# EAGLE design frontpanel (EAGLE 9.5.2)
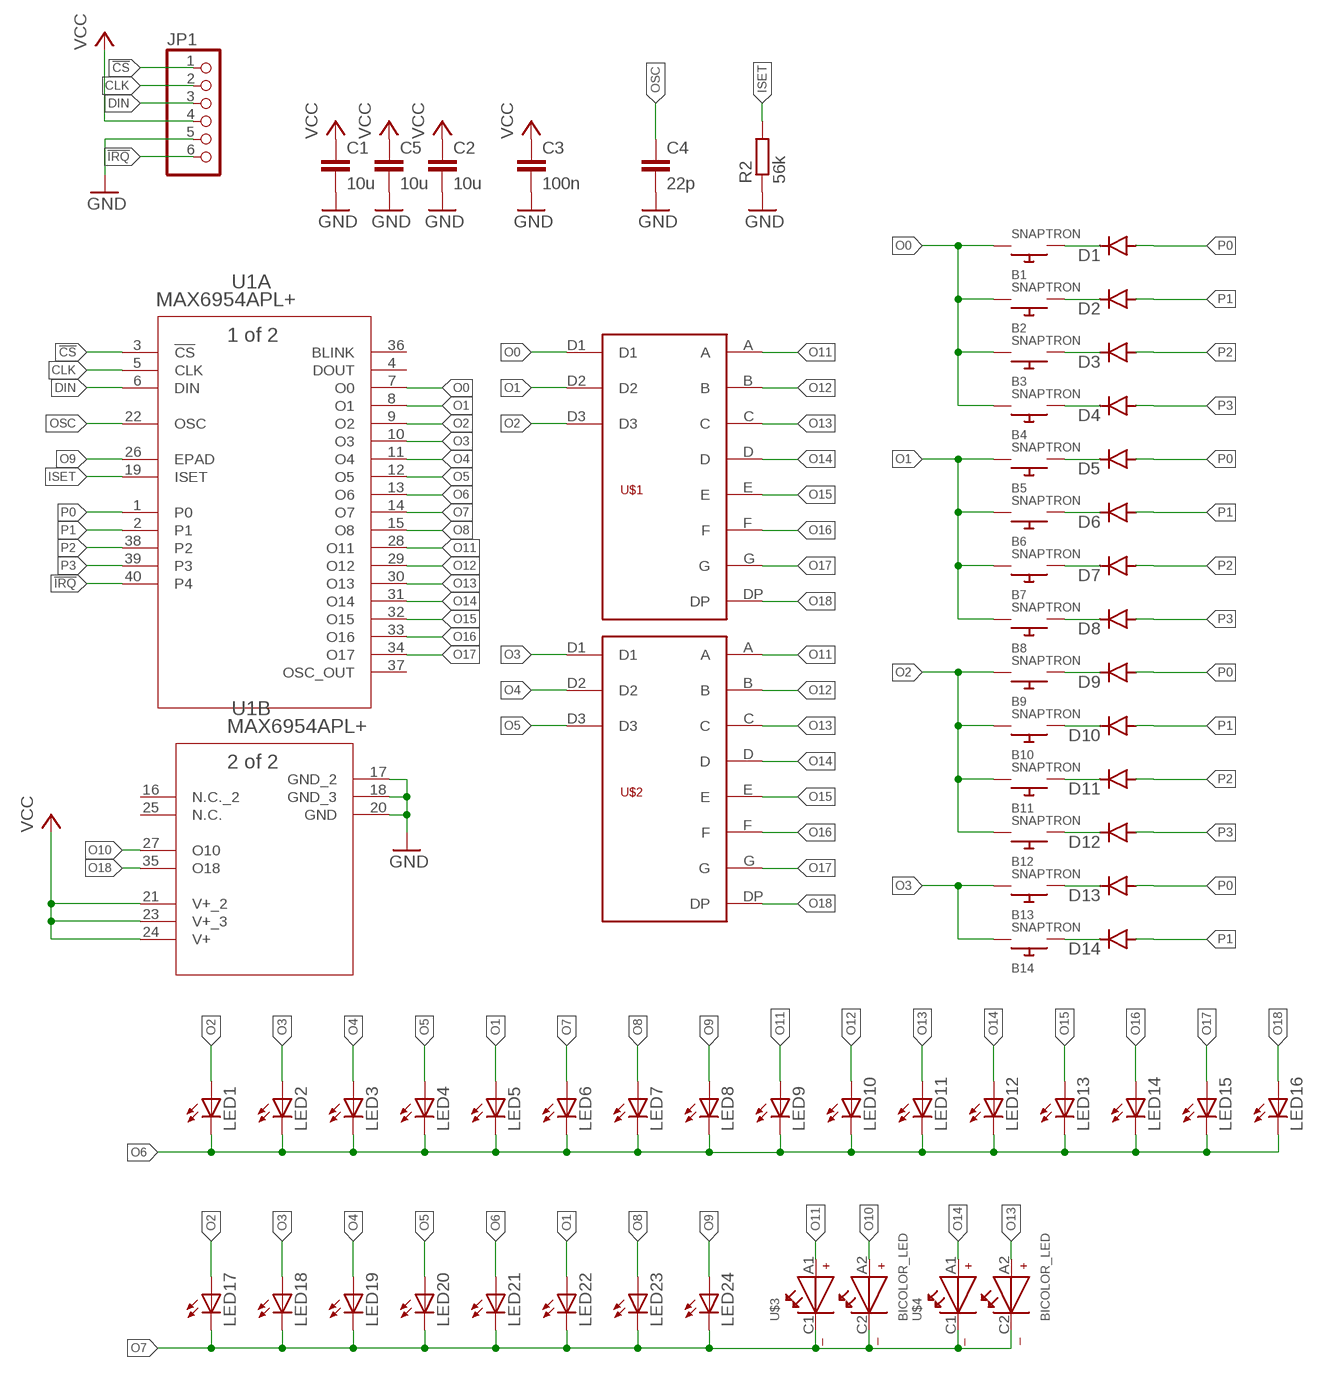
[diagram p0: schematic, sheet 1]

## Parts
B1  SNAPTRON  [SNAPTRON-8.5]
B2  SNAPTRON  [SNAPTRON-8.5]
B3  SNAPTRON  [SNAPTRON-8.5]
B4  SNAPTRON  [SNAPTRON-8.5]
B5  SNAPTRON  [SNAPTRON-8.5]
B6  SNAPTRON  [SNAPTRON-8.5]
B7  SNAPTRON  [SNAPTRON-8.5]
B8  SNAPTRON  [SNAPTRON-8.5]
B9  SNAPTRON  [SNAPTRON-8.5]
B10  SNAPTRON  [SNAPTRON-8.5]
B11  SNAPTRON  [SNAPTRON-8.5]
B12  SNAPTRON  [SNAPTRON-8.5]
B13  SNAPTRON  [SNAPTRON-8.5]
B14  SNAPTRON  [SNAPTRON-8.5]
C1  10u  C-EUC0805  [C0805]
C2  10u  C-EUC0805  [C0805]
C3  100n  C-EUC0805  [C0805]
C4  22p  C-EUC0805  [C0805]
C5  10u  C-EUC0805  [C0805]
D1  1N4148DO35-10  [DO35-10]
D2  1N4148DO35-10  [DO35-10]
D3  1N4148DO35-10  [DO35-10]
D4  1N4148DO35-10  [DO35-10]
D5  1N4148DO35-10  [DO35-10]
D6  1N4148DO35-10  [DO35-10]
D7  1N4148DO35-10  [DO35-10]
D8  1N4148DO35-10  [DO35-10]
D9  1N4148DO35-10  [DO35-10]
D10  1N4148DO35-10  [DO35-10]
D11  1N4148DO35-10  [DO35-10]
D12  1N4148DO35-10  [DO35-10]
D13  1N4148DO35-10  [DO35-10]
D14  1N4148DO35-10  [DO35-10]
JP1  PINHD-1X6  [1X06]
LED1  LEDCHIP-LED0805  [CHIP-LED0805]
LED2  LEDCHIP-LED0805  [CHIP-LED0805]
LED3  LEDCHIP-LED0805  [CHIP-LED0805]
LED4  LEDCHIP-LED0805  [CHIP-LED0805]
LED5  LEDCHIP-LED0805  [CHIP-LED0805]
LED6  LEDCHIP-LED0805  [CHIP-LED0805]
LED7  LEDCHIP-LED0805  [CHIP-LED0805]
LED8  LEDCHIP-LED0805  [CHIP-LED0805]
LED9  LEDCHIP-LED0805  [CHIP-LED0805]
LED10  LEDCHIP-LED0805  [CHIP-LED0805]
LED11  LEDCHIP-LED0805  [CHIP-LED0805]
LED12  LEDCHIP-LED0805  [CHIP-LED0805]
LED13  LEDCHIP-LED0805  [CHIP-LED0805]
LED14  LEDCHIP-LED0805  [CHIP-LED0805]
LED15  LEDCHIP-LED0805  [CHIP-LED0805]
LED16  LEDCHIP-LED0805  [CHIP-LED0805]
LED17  LEDCHIP-LED0805  [CHIP-LED0805]
LED18  LEDCHIP-LED0805  [CHIP-LED0805]
LED19  LEDCHIP-LED0805  [CHIP-LED0805]
LED20  LEDCHIP-LED0805  [CHIP-LED0805]
LED21  LEDCHIP-LED0805  [CHIP-LED0805]
LED22  LEDCHIP-LED0805  [CHIP-LED0805]
LED23  LEDCHIP-LED0805  [CHIP-LED0805]
LED24  LEDCHIP-LED0805  [CHIP-LED0805]
R2  56k  R-EU_R0805  [R0805]
U1  MAX6954APL+  [21-0044B_40_MXM]
U$1  3-DIGIT_7-SEGMENT-DISPLAY  [3-DIGIT_7-SEGMENT-DISPLAY]
U$2  3-DIGIT_7-SEGMENT-DISPLAY  [3-DIGIT_7-SEGMENT-DISPLAY]
U$3  BICOLOR_LED  [BICOLOR_LED]
U$4  BICOLOR_LED  [BICOLOR_LED]

## Nets
!CS: JP1.1 U1.3(A:!CS)
!IRQ: JP1.6 U1.40(A:P4)
CLK: JP1.2 U1.5(A:CLK)
DIN: JP1.3 U1.6(A:DIN)
GND: C1.2 C2.2 C3.2 C4.2 C5.2 JP1.5 R2.1 U1.17(B:GND_2) U1.18(B:GND_3) U1.20(B:GND)
ISET: R2.2 U1.19(A:ISET)
N$1: B1.P$2 D1.C
N$2: B2.P$2 D2.C
N$3: B5.P$2 D5.C
N$4: B3.P$2 D3.C
N$5: B4.P$2 D4.C
N$6: B6.P$2 D6.C
N$7: B7.P$2 D7.C
N$8: B8.P$2 D8.C
N$9: B9.P$2 D9.C
N$10: B10.P$2 D10.C
N$11: B11.P$2 D11.C
N$12: B12.P$2 D12.C
N$13: B13.P$2 D13.C
N$14: B14.P$2 D14.C
O0: B1.P$1 B2.P$1 B3.P$1 B4.P$1 U1.7(A:O0) U$1.D1
O1: B5.P$1 B6.P$1 B7.P$1 B8.P$1 LED5.A LED22.A U1.8(A:O1) U$1.D2
O2: B9.P$1 B10.P$1 B11.P$1 B12.P$1 LED1.A LED17.A U1.9(A:O2) U$1.D3
O3: B13.P$1 B14.P$1 LED2.A LED18.A U1.10(A:O3) U$2.D1
O4: LED3.A LED19.A U1.11(A:O4) U$2.D2
O5: LED4.A LED20.A U1.12(A:O5) U$2.D3
O6: LED1.C LED2.C LED3.C LED4.C LED5.C LED6.C LED7.C LED8.C LED9.C LED10.C LED11.C LED12.C LED13.C LED14.C LED15.C LED16.C LED21.A U1.13(A:O6)
O7: LED6.A LED17.C LED18.C LED19.C LED20.C LED21.C LED22.C LED23.C LED24.C U1.14(A:O7) U$3.C1 U$3.C2 U$4.C1 U$4.C2
O8: LED7.A LED23.A U1.15(A:O8)
O9: LED8.A LED24.A U1.26(A:EPAD)
O10: U1.27(B:O10) U$3.A2
O11: LED9.A U1.28(A:O11) U$1.A U$2.A U$3.A1
O12: LED10.A U1.29(A:O12) U$1.B U$2.B
O13: LED11.A U1.30(A:O13) U$1.C U$2.C U$4.A2
O14: LED12.A U1.31(A:O14) U$1.D U$2.D U$4.A1
O15: LED13.A U1.32(A:O15) U$1.E U$2.E
O16: LED14.A U1.33(A:O16) U$1.F U$2.F
O17: LED15.A U1.34(A:O17) U$1.G U$2.G
O18: LED16.A U1.35(B:O18) U$1.DP U$2.DP
OSC: C4.1 U1.22(A:OSC)
P0: D1.A D5.A D9.A D13.A U1.1(A:P0)
P1: D2.A D6.A D10.A D14.A U1.2(A:P1)
P2: D3.A D7.A D11.A U1.38(A:P2)
P3: D4.A D8.A D12.A U1.39(A:P3)
VCC: C1.1 C2.1 C3.1 C5.1 JP1.4 U1.21(B:V+_2) U1.23(B:V+_3) U1.24(B:V+)
Unconnected: U1.4(A:DOUT) U1.16(B:N.C._2) U1.25(B:N.C.) U1.36(A:BLINK) U1.37(A:OSC_OUT)

## Library data of the parts
B1-B14 = 7_segment_lib:SNAPTRON
C1-C5 = rcl:C-EU: CAPACITOR, European symbol; SPICEPREFIX: C
D1-D14 = diode:1N4148: DIODE high speed (Philips)
JP1 = pinhead:PINHD-1X6: PIN HEADER
LED1-LED24 = adafruit:LED: LED OSRAM: - CHIPLED LG R971, LG N971, LY N971, LG Q971, LY Q971, LO R971, LY R971 LH N974, LH R974 LS Q976, LO Q976, LY Q976 LO Q996 - Hyper CHIPLED LW Q18S LB Q993, LB Q99A, LB R99A - SideLED LS A670, LO A670, LY A670, LG A670, LP A670 LB A673, LV A673, LT A673, LW A673 LH A674 LY A675 LS A676, LA A676, LO A676, LY A676, LW A676 LS A679, LY A679, LG A679 - Hyper Micro SIDELED® LS Y876, LA Y876, LO Y876, LY Y876 LT Y87S - SmartLED LW L88C, LW L88S LB L89C, LB L89S, LG L890 LS L89K, LO L89K, LY L89K LS L896, LA L896, LO L896, LY L896 - TOPLED LS T670, LO T670, LY T670, LG T670, LP T670 LSG T670, LSP T670, LSY T670, LOP T670, LYG T670 LG T671, LOG T671, LSG T671 LB T673, LV T673, LT T673, LW T673 LH T674 LS T676, LA T676, LO T676, LY T676, LB T676, LH T676, LSB T676, LW T676 LB T67C, LV T67C, LT T67C, LS T67K, LO T67K, LY T67K, LW E67C LS E67B, LA E67B, LO E67B, LY E67B, LB E67C, LV E67C, LT E67C LW T67C LS T679, LY T679, LG T679 LS T770, LO T770, LY T770, LG T770, LP T770 LB T773, LV T773, LT T773, LW T773 LH T774 LS E675, LA E675, LY E675, LS T675 LS T776, LA T776, LO T776, LY T776, LB T776 LHGB T686 LT T68C, LB T68C - Hyper Mini TOPLED® LB M676 - Mini TOPLED Santana® LG M470 LS M47K, LO M47K, LY M47K Source: http://www.osram.convergy.de/
R2 = rcl:R-EU_: RESISTOR, European symbol; SPICEPREFIX: R
U1 = 7_segment_lib:MAX6954APL+; BUILT_BY: EMA_UL_Team; MANUFACTURER_PART_NUMBER: MAX6954APL+; SOURCELIBRARY: Maxim_2014-05-21; VENDOR: Maxim Integrated Products
U$1 U$2 = 7_segment_lib:3-DIGIT_7-SEGMENT-DISPLAY
U$3 U$4 = 7_segment_lib:BICOLOR_LED

## Board
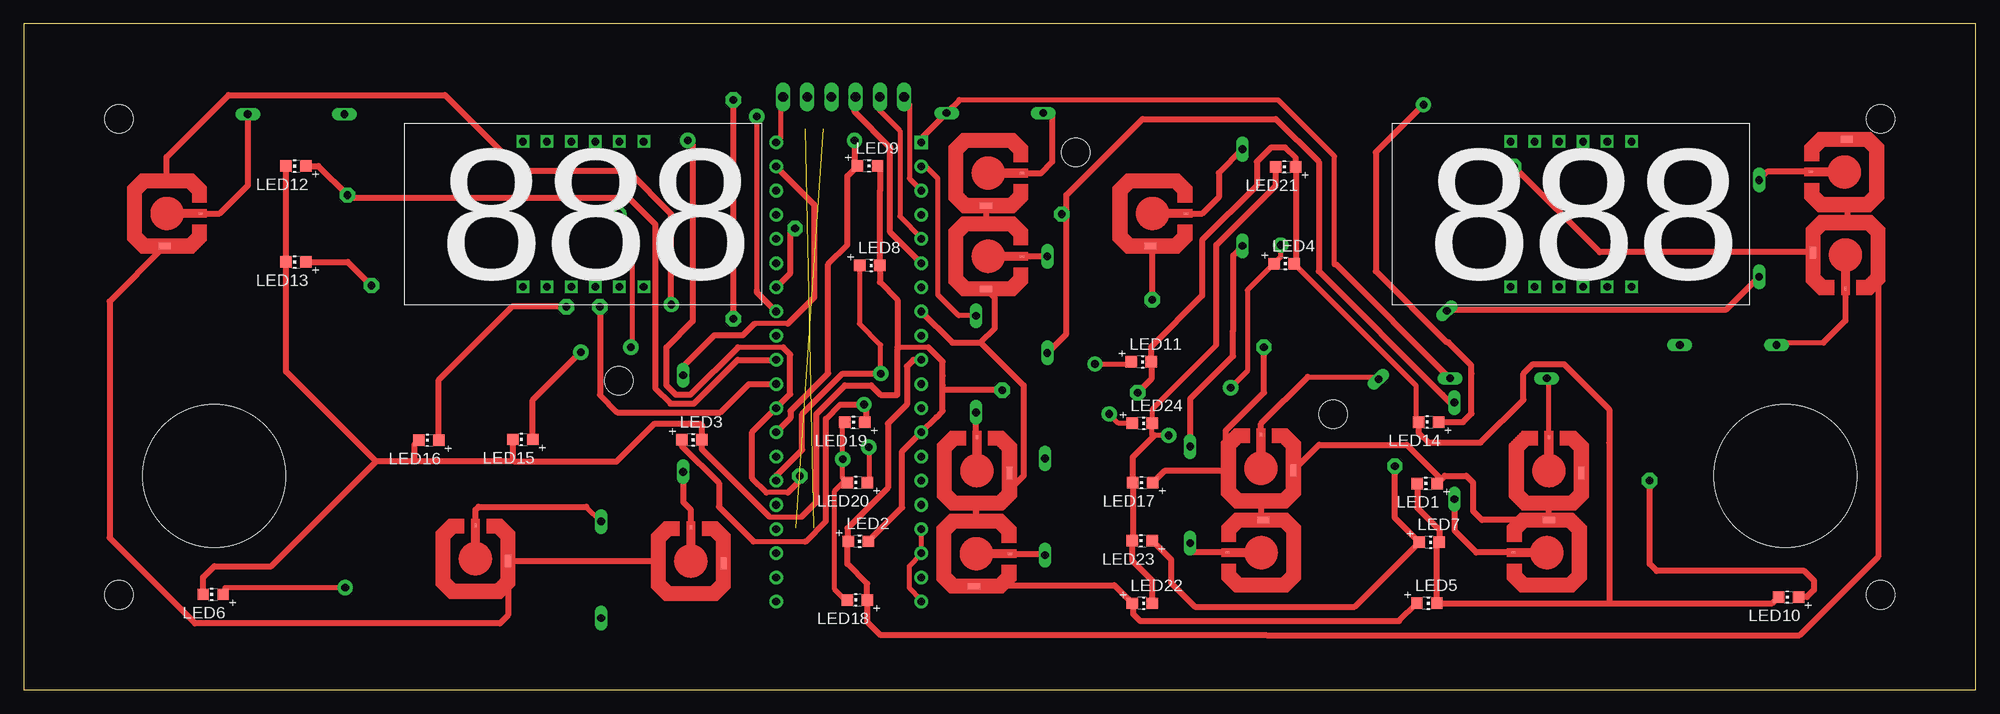
[diagram p1: board, top side]
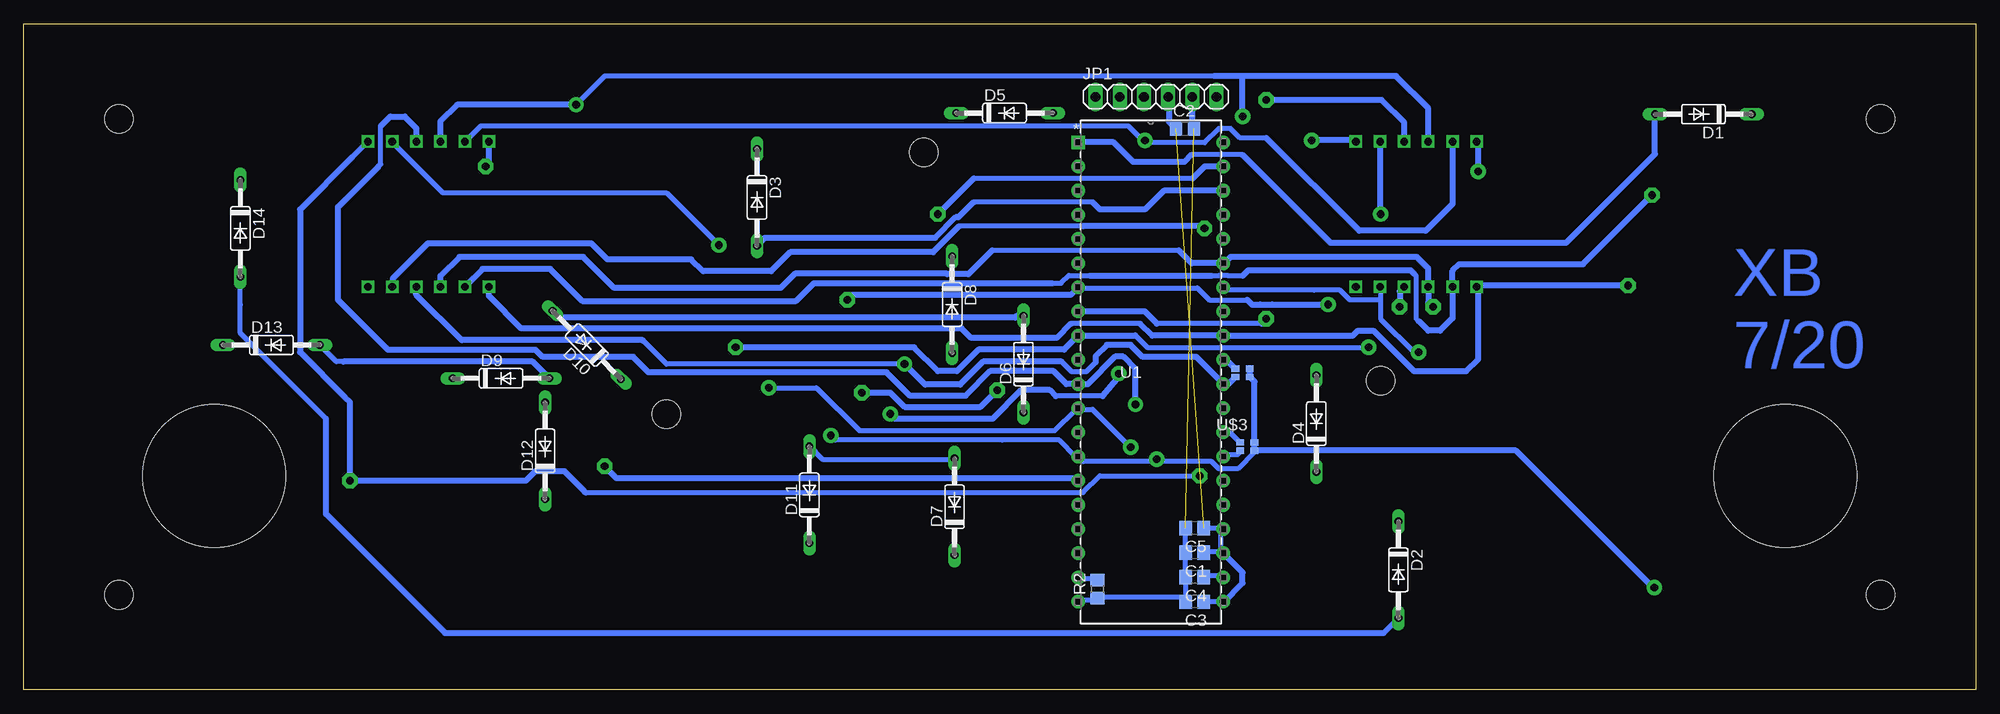
[diagram p2: board, bottom side, seen from below]

Size 205 x 70 mm. Coordinates in mm from the lower left corner, seen from the top.
Outline: 0,0 205,0 205,70 0,70 0,0
Copper layers (1*16): Top 0.035mm / dielectric 1.5mm / Bottom 0.035mm
Design rules "default *": minimum track width 20mil, minimum drill 0.8mm, track to track 12mil, track to pad 10mil, pad to pad 16mil, via to via 16mil, smd to smd 4mil, copper to edge 2mil, drill to drill 6mil, minimum pad ring 10mil, minimum via ring 16mil, stop-mask expansion 4mil, vias tented up to drill 0mil, thermal gap 10mil
Holes 15 mm at 20,22.5 185,22.5
Holes 3 mm at 10,10 10,60 195,10 195,60 62.5,32.5 137.5,29 110.5,56.5

### Footprints (pad centres in the part's own frame; a part is rotated, then mirrored left to right if it is on the bottom)
SNAPTRON-8.5 = smd 1.27 x 0.635: P$1 -0.191,-3.352 | smd 0.406 x 0.203: P$2 3.568,0.056
C0805 = smd 1.3 x 1.5: 1 -0.95,0; 2 0.95,0
DO35-10 = drill 0.813 long: A 5.08,0; C -5.08,0
1X06 = drill 1.016 long: 1 -6.35,0; 2 -3.81,0; 3 -1.27,0; 4 1.27,0; 5 3.81,0; 6 6.35,0
CHIP-LED0805 = smd 1.2 x 1.2: A 0,-1.05; C 0,1.05
R0805 = smd 1.3 x 1.5: 1 -0.95,0; 2 0.95,0
21-0044B_40_MXM = drill 0.8 pad 1.422 square: 1 0,0 | drill 0.8 pad 1.422: 2 0,-2.54; 3 0,-5.08; 4 0,-7.62; 5 0,-10.16; 6 0,-12.7; 7 0,-15.24; 8 0,-17.78; 9 0,-20.32; 10 0,-22.86; 11 0,-25.4; 12 0,-27.94; 13 0,-30.48; 14 0,-33.02; 15 0,-35.56; 16 0,-38.1; 17 0,-40.64; 18 0,-43.18; 19 0,-45.72; 20 0,-48.26; 21 15.24,-48.26; 22 15.24,-45.72; 23 15.24,-43.18; 24 15.24,-40.64; 25 15.24,-38.1; 26 15.24,-35.56; 27 15.24,-33.02; 28 15.24,-30.48; 29 15.24,-27.94; 30 15.24,-25.4; 31 15.24,-22.86; 32 15.24,-20.32; 33 15.24,-17.78; 34 15.24,-15.24; 35 15.24,-12.7; 36 15.24,-10.16; 37 15.24,-7.62; 38 15.24,-5.08; 39 15.24,-2.54; 40 15.24,0
3-DIGIT_7-SEGMENT-DISPLAY = drill 0.8 square: A -3.81,7.62; B 6.35,7.62; C 1.27,-7.62; D -3.81,-7.62; D1 -6.35,7.62; D2 1.27,7.62; D3 3.81,7.62; DP -1.25,-7.62; E -6.35,-7.62; F -1.25,7.62; G 3.81,-7.62; NC 6.35,-7.62
BICOLOR_LED = smd 0.8 x 0.65: A1 0,0; A2 0,-0.85; C1 1.5,0; C2 1.5,-0.85

### Placement (x,y rotation side)
B1  15,50 0 top
B2  47.5,13.75 90 top
B3  118.5,50 0 top
B4  70.12,13.5 90 top
B5  101.25,54.25 0 top
B6  100.17,23 90 top
B7  100,14.25 0 top
B8  101.25,45.5 0 top
B9  160.25,23 90 top
B10  130,23.25 90 top
B11  130,14.5 180 top
B12  160,14.5 180 top
B13  191.25,45.75 270 top
B14  191.25,54.5 180 top
C1  82.03,14.44 180 bottom
C2  83.05,58.98 0 bottom
C3  82.03,9.27 180 bottom
C4  82.03,11.85 180 bottom
C5  82.03,17.02 180 bottom
D1  28.6,60.5 180 bottom
D2  60.62,12.62 270 bottom
D3  128,51.75 270 bottom
D4  69.25,28 90 bottom
D5  102,60.62 0 bottom
D6  100,34.25 90 bottom
D7  107.25,19.25 90 bottom
D8  107.5,40.5 270 bottom
D9  154.88,32.75 0 bottom
D10  145.88,36.25 135 bottom
D11  122.5,20.5 90 bottom
D12  150.25,25.12 90 bottom
D13  179,36.25 0 bottom
D14  182.25,48.5 270 bottom
JP1  86.09,62.33 0 bottom
LED1  147.39,21.7 90 top
LED2  87.64,15.62 270 top
LED3  70.14,26.29 270 top
LED4  132.36,44.79 270 top
LED5  147.36,9.12 270 top
LED6  19.89,10.05 90 top
LED7  147.61,15.53 270 top
LED8  88.86,44.61 270 top
LED9  88.61,55.06 270 top
LED10  185.35,9.77 90 top
LED11  117.36,34.47 270 top
LED12  28.6,55.06 90 top
LED13  28.6,44.98 90 top
LED14  147.53,28.16 90 top
LED15  52.41,26.32 90 top
LED16  42.53,26.25 90 top
LED17  117.53,21.79 90 top
LED18  87.53,9.46 90 top
LED19  87.28,28.13 90 top
LED20  87.53,21.8 90 top
LED21  132.53,54.97 90 top
LED22  117.47,9.11 270 top
LED23  117.47,15.69 90 top
LED24  117.47,28.02 270 top
R2  92.23,10.61 90 bottom
U1  94.25,57.55 0 bottom
U$1  58.75,50 0 top
U$2  162.5,50 0 top
U$3  77.25,26 0 bottom
U$4  77.75,33.75 0 bottom

### Tracks (layer width: path | path; a pad name or v marks a point on that pad's centre or on a via)
!CS
  Top 0.508: U1.3 94.25,52.5 93,53.75 93,61.58 JP1.1
!IRQ
  Top 0.508: U1.40 79.25,57.75 79.5,58 79.5,62.25 JP1.6
CLK
  Top 0.508: JP1.2 89.9,60.85 92,58.75 92,49.75 94.25,47.5 U1.5
DIN
  Top 0.508: 87.25,62.25 JP1.3
  Top 0.61: U1.6 91,48.1 91,57 87.25,60.75 87.25,62.25
GND  (1 unrouted)
  Top 0.508: U1.17 94.25,16.75 94.25,14.5 U1.18 94.25,14.25 93,13 93,10.75 94.25,9.5 U1.20
  Bottom 0.508: 82.25,62.25 JP1.5 | U1.20 94.25,9.5 92.25,9.5 R2.1 92,9.75 83.25,9.75 C3.2 83,9.5 83,11.75 C4.2 83,12 83,14.25 C1.2 83,14.5 83,17 C5.2
  Bottom 0.61: C2.2 82.25,59.13 82.25,62.25
ISET
  Bottom 0.508: R2.2 92.25,11.75 94.25,11.75 U1.19
N$1
  Top 0.61: B1.P$2 20.56,50.06 23.52,53.02 D1.C
N$2
  Top 0.508: 59.08,19.25 D2.C
  Top 0.61: B2.P$2 47.44,18.94 47.75,19.25 59.08,19.25
N$3
  Top 0.61: B5.P$2 106.81,54.31 108,55.5 108,60.5 107.88,60.62 D5.C
N$4
  Top 0.61: B3.P$2 123.77,50.06 125.5,51.78 125.5,54.33 D3.C
N$5
  Top 0.61: B4.P$2 70.07,18.93 69.25,19.75 D4.C
N$6
  Top 0.61: B6.P$2 100,26.68 D6.C
N$7
  Top 0.61: B7.P$2 107.11,14.31 D7.C
N$8
  Top 0.61: B8.P$2 104.84,45.58 D8.C
N$9
  Top 0.508: B9.P$2 160.19,32.51 D9.C
N$10
  Top 0.508: 134.85,32.91 142.03,32.91 D10.C
  Top 0.61: 134.85,32.91 129.94,28 B10.P$2
N$11
  Top 0.61: D11.C 122.5,14.44 B11.P$2
N$12
  Top 0.61: B12.P$2 152.56,14.44 150.25,16.75 D12.C
N$13
  Top 0.508: D13.C 184.33,36.5 189,36.5
  Top 0.61: B13.P$2 191.31,38.81 189,36.5
N$14
  Top 0.61: B14.P$2 183.11,54.44 D14.C
O0  (via drill 0.8)
  Top 0.61: B4.P$1 73.48,10.98 72.5,10 67.5,10 66.5,11 66.5,13.5 50.91,13.5 B2.P$1 50.85,7.85 50,7 18,7 9,16 9,40.84 B1.P$1 12.35,46.65 11.5,47.5 11.5,52.5 12.5,53.5 15,53.5 15,56 21.5,62.5 44.25,62.5 v52.25,54.5 63.5,54.5 68,50 v68,40.5 | B3.P$1 118.5,46.46 v118.5,41
  Bottom 0.508: U1.7 94.25,42.25 81.75,42.25 80.5,41 76.5,41
  Bottom 0.61: 76.5,41 76,40.5 75.15,40.5 75.13,40.52 73.87,40.52 73.85,40.5 v68,40.5 | U1.7 95.06,41.5 118,41.5 v118.5,41 | v52.25,54.5 52.25,57.47 U$1.D1
O1  (via drill 0.8)
  Top 0.61: B6.P$1 103.52,22 | 103.52,22 103.52,21.02 | 102,19.5 100.25,19.5 100,19.5 | 100,18 100,19 | 100,19 100,19.5 | 100,18 98,18 96.5,16.5 96.5,14 | 96.5,12 97.5,11 | 103.52,21.02 103.5,21 | 103.5,21 105,22.5 105,32 100.5,36.5 | 103.5,21 102.5,20 | 102.5,20 102.25,19.75 | 102.25,19.75 102,19.5 | 96.5,14 96.5,12 | 97.5,11 98.5,11 | 98.5,11 114.53,11 LED22.A 116.5,9.03 116.5,8 117.25,7.25 144.44,7.25 LED5.A | 100,19.5 98,19.5 97.5,20 | 97.5,20 96.5,21 97.5,20 | B5.P$1 101.06,49.44 101.25,49.25 99.25,49.25 98,48 98,43.5 99.35,42.15 B8.P$1 102,41.21 102,38 100.5,36.5 | v74.5,62 v74.5,39 | 103.52,22 103.52,21.02 | 103.52,21.02 103.5,21 | 102.5,20 102.25,19.75 | 102.25,19.75 102,19.5 | 100,19 100,18 | 96.5,14 96.5,12 | 96.5,12 97.5,11 | 103.52,21.02 103.5,21 | B7.P$1 99.71,11 98.5,11 | U1.8 97.52,36.5 100.5,36.5 | 103.5,21 102.25,19.75
  Bottom 0.508: 75,38.5 86,38.5
  Bottom 0.61: U$1.D2 60.02,59.62 62.4,62 71.5,62 v74.5,62 | v74.5,39 75,38.5 | U1.8 87.27,39.77 86,38.5
O2  (via drill 0.8)
  Top 0.508: v62.5,50 63.88,48.62 63.88,36.12 v63.75,36
  Top 0.61: 130,20 132.5,20 133.35,20.85 B10.P$1 136.04,25.75 145.25,25.75 148.87,22.13 | 130,20 127.5,20 126.5,21 126.5,23 | 126.5,23 126.25,23.25 126.25,27.25 130.25,31.25 v130.25,36 | LED1.A 148.87,22.13 | 148.87,22.13 149.24,22.5 151.5,22.5 152.23,21.77 152.23,18.77 153.15,17.85 B12.P$1 160.19,19.19 161,20 163,20 163.5,20.5 163.5,22.71 B9.P$1 | B11.P$1 130,18.04 130,20 | 126.5,23 119.79,23 LED17.A
  Bottom 0.508: v63.75,36 87,36 88.25,37.25
  Bottom 0.61: 88.25,37.25 94.23,37.25 U1.9 94.27,37.23 95.73,35.77 104.73,35.77 107.01,33.49 108.99,33.49 111.5,36 v130.25,36 | U$1.D3 62.56,50.06 v62.5,50
O3  (via drill 0.8)
  Top 0.61: B14.P$1 193.65,57.85 194.5,57 194.5,52 193.5,51 191.5,51 191.5,49.5 | 191.5,49.5 191,49 189,49 187.9,47.9 B13.P$1 187.84,46 165.5,46 v156.5,55 | 191.5,49.5 192,49 194.25,49 194.75,48.5 194.75,14 186.5,5.75 130.5,5.75 90,5.75 88.58,7.17 LED18.A 88.58,11.17 86.5,13.25 86.5,15.25 | 86.5,15.25 86.5,15.53 LED2.A | U1.10 93.44,34.69 92.75,34 92.75,30 90.75,28 90.75,21.25 86.5,17 86.5,15.25
  Bottom 0.508: 156.12,57.64 U$2.D1
  Bottom 0.61: v156.5,55 156.12,55.38 156.12,57.64
O4  (via drill 0.8)
  Top 0.508: 76.64,15.61 82,15.61 | 82.03,15.58 82.08,15.58
  Top 0.61: LED19.A 88.45,28.25 88.45,29.8 v88.25,30 85.75,30 84.25,28.5 84.25,17.75 82.08,15.58 | LED3.A 69.09,25.66 73,21.75 73,19.25 76.64,15.61 | 82,15.61 82.03,15.58
  Bottom 0.508: 167.75,55 167.5,55.25 167.5,59.25
  Bottom 0.61: v88.25,30 88.25,33.75 89.52,35.02 90.38,35.02 93.25,32.15 U1.11 95.5,32.15 96.85,33.5 103.5,33.5 106.09,30.91 111.91,30.91 114.39,33.39 139.39,33.39 141,35 150.5,35 151.25,35.75 166.75,35.75 172,41 172,50.75 167.75,55 | 167.5,59.25 166.5,60.25 165,60.25 163.77,59.02 U$2.D2
O5  (via drill 0.8)
  Top 0.508: v88.75,25.5 88.75,22 LED20.A | v132,46.75 132,45.5 131.5,45 LED4.A 131.25,44.75 128.5,42 128.5,33.5 v126.75,31.75
  Bottom 0.508: v88.75,25.5 92.75,29.5 94.25,29.5 U1.12 94.5,29.5 96.75,27.25 117.25,27.25 121.75,31.75 v126.75,31.75 | v132,46.75 137.5,52.25 161,52.25 166.25,57.5 U$2.D3
O6  (via drill 0.8)
  Top 0.508: 133.5,45 LED4.C 146.25,31.95 146.25,28.25 LED14.C | 184.25,9.75 LED10.C | LED12.C LED13.C | 78.3,18.2 81.7,18.2 | 95,36 91.75,36
  Top 0.61: 166.5,9.12 LED5.C 148.41,15.28 LED7.C 148.66,16.84 146.34,19.16 LED1.C | 166.5,9.12 183.62,9.12 184.25,9.75 | LED6.C 18.84,11.84 20,13 26,13 37,24 | LED15.C 51.35,24.14 51.5,24 | LED12.C 27.55,33.45 37,24 | 51.5,24 41,24 | 41,24 37,24 | LED16.C 41,25.77 41,24 | 133.5,45 133.58,45.08 LED21.A 133.58,55.92 132.5,57 131,57 129.5,55.5 129.5,53 123.75,47.25 123.75,41.43 118.41,36.09 LED11.C 118.41,32.66 v117,31.25 | 166.5,9.12 166.5,26 166.5,29.5 161.75,34.25 158.5,34.25 157.5,33.25 157.5,30.5 153,26 147.5,26 146.48,27.02 LED14.C | 51.5,24 62.25,24 66.25,28 71,28 71.25,27.75 71.25,26.35 LED3.C 71.19,25.31 78.3,18.2 | 81.7,18.2 83.25,19.75 83.25,29 86.25,32 89,32 90,31 91.75,31 91.75,35.75 91.75,36 91.75,41 89.91,42.84 LED8.C 89.91,52.44 89.91,54.81 LED9.C | LED2.C 92.25,19.18 92.25,25.07 U1.13 95.84,28.66 96.5,29.32 96.5,31.5 | 96.5,31.5 96.5,32 96.5,33 96.5,34.5 95,36 | v102.75,31.5 96.5,31.5
  Bottom 0.61: v117,31.25 114,31.25 112.5,29.75 104.5,29.75 v102.75,31.5
O7  (via drill 0.8)
  Top 0.508: 125.25,36.25 118.52,29.52 LED24.C 118.5,28 118.5,26.75 118.75,26.75 v120.25,26.75 | 131.25,54.75 LED21.C | LED19.C 86,27.9 v86,24.25 86,22.22 LED20.C 85.93,21.68 85.11,20.86 85.11,10.64 86.25,9.5 LED18.C | v33.75,10.75 21.15,10.75 LED6.A
  Top 0.61: 131.25,54.75 131.5,55 131.5,53 125.25,46.75 125.25,36.25 | 118.75,26.75 116.48,24.48 LED17.C 116.48,15.75 LED23.C 116.42,13.58 118.52,11.48 LED22.C
  Bottom 0.508: 86,24 80.25,24 79.5,23.25 77.5,23.25 75.75,25 U$3.C2 | 86,24 93.75,24 94.25,24.5 U1.14 94.5,24.5 96.25,26.25 102.25,26.25 119.75,26.25 v120.25,26.75 | v86,24.25 86,24
  Bottom 0.61: U$4.C1 U$4.C2 75.75,32.4 U$3.C1 U$3.C2 48.27,25.15 33.88,10.75 v33.75,10.75
O8  (via drill 0.8)
  Top 0.61: v144,23.5 144,18.09 LED7.A 139.78,8.75 123,8.75 120.5,11.25 120.5,13.71 LED23.A
  Bottom 0.61: v144,23.5 142.75,22.25 94.51,22.25 U1.15
O9  (via drill 0.8)
  Top 0.508: LED8.A 87.75,44.55 87.75,38.5 90,36.25 v90,33.25 | LED24.A 114.98,28.02 v114,29
  Top 0.61: U1.26 79.01,22.51 81.75,25.25 81.75,29 86,33.25 v90,33.25
  Bottom 0.508: 91.69,30.89 96.64,30.89
  Bottom 0.61: v90,33.25 90,32.96 91.69,30.89 | v114,29 113.5,28.5 103.25,28.5 100.25,31.5 97.25,31.5 96.64,30.89
O10
  Bottom 0.508: U$3.A2 77.25,25 77.5,24.75 79,24.75 U1.27
O11  (via drill 0.8)
  Top 0.61: v87.25,57.75 87.25,55.38 LED9.A 86.5,54.01 86.5,46.75 84.48,44.73 84.48,33.28 80.51,29.3 80.51,28.57 U1.28
  Bottom 0.508: U$3.A1 78.25,27 79,27 U1.28 | 74.5,58 77.25,58 78.25,59 79.5,59 81,57.5 87,57.5 v87.25,57.75 87.5,57.75 89,59.25 157,59.25 158.5,57.75 U$2.A
  Bottom 0.61: U$1.A 54.94,51.06 57.75,48.25 64.75,48.25 74.5,58
O12  (via drill 0.8)
  Top 0.508: 79.75,36 75,36 | 80.25,20.75 78,20.75
  Top 0.61: 79.75,36 80.5,35.25 80.5,31.1 U1.29 76.5,27.1 76.5,22.25 78,20.75 | LED10.A 187.26,9.77 188,10.5 188,11.5 187,12.5 171.5,12.5 170.75,13.25 v170.75,22 | v69.75,57.75 70.25,57.25 70.25,38.75 67.5,36 67.5,32 68.5,31 70,31 75,36 | v81.5,22.5 81.5,22 80.25,20.75
  Bottom 0.508: 170.5,56 169,57.5 U$2.B | v81.5,22.5 92,22.5 93.75,20.75 93.77,20.73 145.98,20.73
  Bottom 0.61: 170.5,56 176,50.5 176,35.5 171.25,30.75 170.75,30.25 v170.75,22 152.25,22 151.25,23 148.25,23 146.25,21 145.98,20.73 | U$1.B 65.23,57.75 v69.75,57.75
O13  (via drill 0.8)
  Top 0.508: v112.5,34.25 116.25,34.25 LED11.A
  Top 0.61: v60.5,40.25 60.5,31 62.33,29.17 73.17,29.17 76.15,32.15 U1.30
  Bottom 0.508: v112.5,34.25 137.5,34.25 139.97,36.72 | 92.43,34.43 93.43,33.42 94.92,33.42 96,34.5
  Bottom 0.61: U$1.C 60.5,41.9 v60.5,40.25 | U$4.A2 78.5,32.15 U1.30 81.86,35 87.5,35 88.75,36.25 91.25,36.25 92.43,35.07 92.43,34.43 | 96,34.5 104.25,34.5 106.67,32.08 110.33,32.08 v112.5,34.25 | 139.97,36.72 140,36.75 159,36.75 163.77,41.52 U$2.C
O14  (via drill 0.8)
  Top 0.61: LED12.A 30.94,55.06 v34,52 34.25,51.75 63.5,51.75 66.31,48.94 66.31,31.69 67.91,30.09 70.38,30.09 74.98,34.69 79.06,34.69 U1.31
  Bottom 0.508: 149.72,44.25 156.75,44.25 158.5,42.5 U$2.D | 93,43.5 93.06,43.56 95.25,43.56 96.06,42.75 97,42.75 | 58.5,38.75 58.75,39 58.75,43.5 59,43.75 | 146.36,40.89 123.89,40.89 | 77,43.5 78.48,43.5 78.5,43.53 79.52,43.53 79.54,43.5 80.25,43.5
  Bottom 0.61: v34,52 41.25,44.75 54.25,44.75 54.94,44.06 U$1.D 54.94,39.06 56.25,37.75 57.5,37.75 58.5,38.75 | U$4.A1 78.69,34.69 U1.31 | 59,43.75 59.34,44.09 76.41,44.09 77,43.5 | 80.25,43.5 93,43.5 | U$2.D 156.82,44.25 156.75,44.25 149.72,44.25 146.36,40.89 123.89,40.89 122.03,42.75 97,42.75
O15  (via drill 0.8)
  Top 0.61: LED13.A 34.02,44.98 v36.5,42.5
  Bottom 0.508: 52.25,42.25 U$1.E | 87.75,38.5 95,38.5
  Bottom 0.61: 87.75,38.5 86.48,37.23 U1.32 65.42,37.23 64.88,37.77 63.27,37.77 59,33.5 53.5,33.5 52.25,34.75 52.25,42.25 52,42.5 v36.5,42.5 | 95,38.5 96.5,37 105.5,37 106.5,38 152.75,38 156.15,41.4 U$2.E
O16  (via drill 0.8)
  Top 0.508: 77,42 v77,60.25
  Top 0.61: LED14.A 151.16,28.16 152.05,29.05 152.05,33.25 152,33.3 152,34.15 151.64,34.51 149.63,36.52 149.48,36.52 142,44 142,56.5 v147,61.5 | U1.33 77,41.78 77,42
  Bottom 0.508: 161.25,57.5 U$2.F | v147,61.5 144,64.5 93,64.5 80,64.5
  Bottom 0.61: v147,61.5 159.5,61.5 161.25,59.75 161.25,57.5 | 77,64.5 80,64.5 | v77,60.25 77,64.5 | 77,64.5 60.88,64.5 57.5,61.12 U$1.F
O17  (via drill 0.8)
  Top 0.61: U1.34 80.51,43.81 80.51,48.01 v81,48.5 | LED15.A 53.45,30.45 v58.5,35.5
  Bottom 0.508: v58.5,35.5 59,35.5 62.5,39 62.5,41 | 62.5,41 62.5,42.25 U$1.G | U1.34 79,42.25 78.75,42 69.5,42 66.75,42 65.75,41 62.75,41 62.5,41 | 166.25,42.5 U$2.G | 93.76,48.74 106.76,48.74
  Bottom 0.61: v81,48.5 81.25,48.75 93.74,48.75 93.76,48.74 | 106.76,48.74 109.5,46 124.5,46 126.5,44 133.65,44 134.9,45.25 143.71,45.25 145.37,46.91 162.59,46.91 166.25,43.25 166.25,42.5
O18  (via drill 0.8)
  Top 0.61: LED16.A 43.58,32.58 51.27,40.27 56.98,40.27 v57,40.25
  Bottom 0.508: 79,44.75 U1.35 | 83.7,46.2 103.3,46.2
  Bottom 0.61: v57,40.25 57.5,40.75 U$1.DP 57.5,44.29 58.71,45.5 78.25,45.5 79,44.75 | U1.35 82.35,44.85 83.7,46.2 | U$2.DP 161.25,43.5 159.25,45.5 146.25,45.5 143,42.25 125.5,42.25 124,43.75 108.06,43.75 108,43.7 105.8,43.7 103.3,46.2
OSC
  Bottom 0.508: C4.1 81,12 79.25,12 U1.22
P0
  Top 0.508: 137.67,44.75 137.67,56.08 131.75,62 98.25,62
  Top 0.61: D9.A 137.79,44.75 137.67,44.75 | 98.25,62 96.92,60.67 D5.A 94.25,57.95 U1.1
  Bottom 0.508: 77.02,56.25 82.35,56.25 | 171.42,34.5 172.17,34.5 D13.A
  Bottom 0.61: 171.42,34.5 151.54,34.5 D9.A | 82.35,56.25 83.12,55.48 88.48,55.48 90.55,57.55 U1.1 | 77.02,56.25 67.77,47 43,47 33.68,56.32 D1.A
P1
  Top 0.508: U1.2 94.74,55.01 96,53.75 96,41.5 98.17,39.33 D6.A | D10.A 149.72,40.09 149.91,40.09
  Top 0.61: D14.A 178.83,40 150,40 149.91,40.09
  Bottom 0.508: D14.A 182.25,40.5 182.25,37.5 173.25,28.5 | 62.17,6 D2.A
  Bottom 0.61: 173.25,28.5 173.25,18.5 160.75,6 62.17,6 | D10.A 148.75,39.12 100.88,39.12 100.67,39.33 D6.A
P2
  Top 0.61: D3.A 127,45.67 127,37.75 127,35.08 122.5,30.58 D11.A
  Bottom 0.508: 121.88,25 121.12,24.25 107.33,24.25 D7.A | 92.75,51.25 105.25,51.25
  Bottom 0.61: U1.38 85.28,52.47 87.25,50.5 92,50.5 92.75,51.25 | 105.25,51.25 106.84,49.66 107.13,49.66 109.29,47.5 127.17,47.5 D3.A | D11.A 121.92,25 121.88,25
P3  (via drill 0.8)
  Top 0.508: 80.25,38.5 76.75,38.5
  Top 0.61: D8.A 109.5,37.42 109.5,50 | 109.5,50 109.5,52 117.5,60 131.5,60 136,55.5 136,44 149,31 149.79,30.2 | v109,50 109.5,50 | 80.25,38.5 83,41.25 83,51.02 U1.39 | 76.75,38.5 75.5,37.25 72.5,37.25 69.25,34 D4.A | 149.79,30.2 D12.A 149.79,30.2
  Bottom 0.508: 82.25,53.75 105.25,53.75
  Bottom 0.61: v109,50 105.25,53.75 | U1.39 80.99,55.01 82.25,53.75
VCC  (1 unrouted)
  Bottom 0.508: 84.75,62.25 JP1.4 | C5.1 81,17 79.25,17 U1.24 79.25,16.75 79.25,14.75 U1.23 79.25,14.5 81,14.5 C1.1 | C3.1 81,9.25 79.25,9.25 U1.21
  Bottom 0.61: C2.1 84.75,59.73 84.75,62.25 | U1.21 78.96,9.29 77,11.25 77,12.36 U1.23

### Text on the board
Bottom: XB / 7/20
Measures: FREQUENCY | AMPLITUDE | Fc | Hz | Offset | BW | kHz | Q | INPUT | COUPLING | POLARITY | MODE | GAIN | FILTER | OUTPUT | 10 | LP | 5 | Thru | AC | DC | INV | HP | 2 | 4th | BP | 1 | 8th | OVER | OVER | Notch | 0.1 | OFF